# Altium project max2606_VCO.PrjPcb
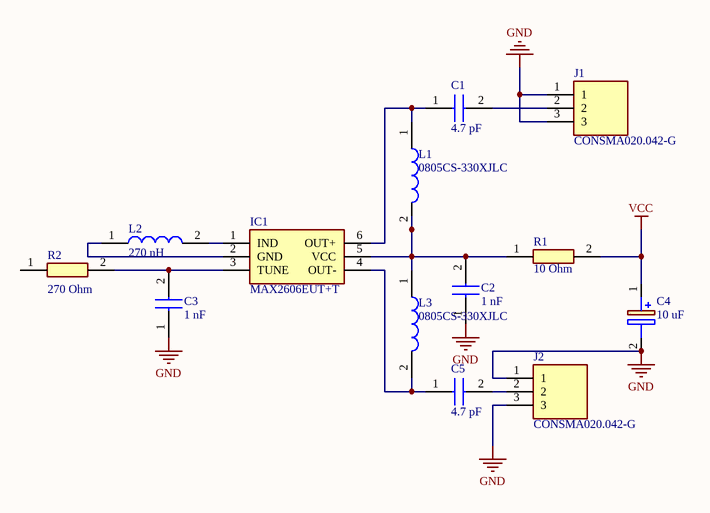
[diagram p0: vco_max2606.SchDoc]
1 sheet, 13 parts. Net scope: global (net labels, ports and power ports of the same name join across sheets).
Board file: VCO_Max2606.PcbDoc

## Sheet vco_max2606.SchDoc
size A4; SheetNumber: 1; SheetTotal: 1

### Parts
C1  4.7 pF  [CAPC1608X90N]
C2  1 nF  [CAPC1608X90N]
C3  1 nF  [CAPC1608X90N]
C4  10 uF  [CAPPM3216X180N]
C5  4.7 pF  [CAPC1608X90N]
IC1  MAX2606EUT+T  [SOT95P280X145-6N]
J1  CONSMA020.042-G  [CONSMA020042G]
J2  CONSMA020.042-G  [CONSMA020042G]
L1  0805CS-330XJLC  [CAPC2012X130N]
L2  270 nH  [INDC2012X105N]
L3  0805CS-330XJLC  [CAPC2012X130N]
R1  10 Ohm  [RESC1608X55N]
R2  270 Ohm  [RESC2012X65N]

### Nets
GND: C2.1 C3.1 C4.2(-) J1.1 J1.3 J2.1 J2.3
VCC: C4.1(+) R1.2
NetC1_1: C1.1 IC1.6(OUT+) L1.1
NetC1_2: C1.2 J1.2
NetC2_2: C2.2 IC1.5(VCC) L1.2 L3.1 R1.1
NetC3_2: C3.2 IC1.3(TUNE) R2.2
NetC5_1: C5.1 IC1.4(OUT-) L3.2
NetC5_2: C5.2 J2.2
NetIC1_1: IC1.1(IND) L2.2
NetIC1_2: IC1.2(GND) L2.1

Not connected (* = marked no-connect by the designer): R2 1

### Library data of the parts
C1 C5 = CL10C4R7BB8NNNC: Capacitor; Manufacturer_Name: SAMSUNG; Datasheet Link: https://datasheet.datasheetarchive.com/originals/distributors/Datasheets_SAMA/0a1f72ba4d3cd833564e5daafcd80580.pdf; Height: 0.9mm; Manufacturer_Part_Number: CL10C4R7BB8NNNC; Mouser Part Number: N/A; Mouser Price/Stock: https://www.mouser.com/Search/Refine.aspx?Keyword=N%2FA; Arrow Part Number: CL10C4R7BB8NNNC; Arrow Price/Stock: https://www.arrow.com/en/products/cl10c4r7bb8nnnc/samsung-electro-mechanics
C2 C3 = 06033D224MAT4A: Capacitor; Manufacturer_Name: Kyocera AVX; Datasheet Link: https://componentsearchengine.com/Datasheets/1/06031A100FAT2A.pdf; Height: 0.9mm; Manufacturer_Part_Number: 06033D224MAT4A; Mouser Part Number: 581-06033D224MAT4A; Mouser Price/Stock: https://www.mouser.co.uk/ProductDetail/AVX/06033D224MAT4A?qs=XLNwXgtzMM%2FMFiOH0A%252BeuQ%3D%3D
C4 = T491A106M010AT7454: Capacitor Polarised; Manufacturer_Name: KEMET; Datasheet Link: https://connect.kemet.com:7667/gateway/IntelliData-ComponentDocumentation/1.0/download/specsheet/T491A106M010AT; Height: 1.8mm; Manufacturer_Part_Number: T491A106M010AT7454; Mouser Part Number: 80-T491A106M10AT7454; Mouser Price/Stock: https://www.mouser.co.uk/ProductDetail/KEMET/T491A106M010AT7454?qs=WOKUqv%2F%2FT%2FY3El0Op9fdSQ%3D%3D; Arrow Part Number: T491A106M010AT7454; Arrow Price/Stock: https://www.arrow.com/en/products/t491a106m010at7454/kemet-corporation?region=nac
IC1 = MAX2606EUT+T: Integrated Circuit; Manufacturer_Name: Analog Devices; Datasheet Link: https://www.mouser.co.uk/datasheet/2/256/MAX2605-MAX2609-1515582.pdf; Height: 1.45mm; Manufacturer_Part_Number: MAX2606EUT+T; Mouser Part Number: 700-MAX2606EUTT; Mouser Price/Stock: https://www.mouser.co.uk/ProductDetail/Analog-Devices-Maxim-Integrated/MAX2606EUT%2bT?qs=GxOUx7aO6nxQrK5ySdDhWg%3D%3D
J1 J2 = CONSMA020.042-G: Connector; Manufacturer_Name: Linx Technologies; Datasheet Link: https://linxtechnologies.com/wp/wp-content/uploads/consma020.042-g-ds.pdf; Height: 7.92mm; Manufacturer_Part_Number: CONSMA020.042-G; Mouser Part Number: 712-CONSMA020.042-G; Mouser Price/Stock: https://www.mouser.co.uk/ProductDetail/Linx-Technologies/CONSMA020.042-G?qs=7D1LtPJG0i3DlJhqoQK7wQ%3D%3D
L1 L3 = 0805CS-330XJLC: Inductor; Manufacturer_Name: COILCRAFT; Datasheet Link: https://www.coilcraft.com/getmedia/dd5f20e4-1ff7-43df-8317-b693eb2dce3e/0805cs.pdf; Height: 1.52mm; Manufacturer_Part_Number: 0805CS-330XJLC; Mouser Part Number: 994-0805CS-330XJLC; Mouser Price/Stock: https://www.mouser.com/Search/Refine.aspx?Keyword=994-0805CS-330XJLC
L2 = MLF2012DR27JTD25: Inductor; Manufacturer_Name: TDK; Datasheet Link: https://product.tdk.com/system/files/dam/doc/product/inductor/inductor/smd/catalog/inductor_automotive_standard_mlf2012_en.pdf; Height: 1.05mm; Manufacturer_Part_Number: MLF2012DR27JTD25; Mouser Part Number: 810-MLF2012DR27JTD25; Mouser Price/Stock: https://www.mouser.co.uk/ProductDetail/TDK/MLF2012DR27JTD25?qs=u4%252BEJ9urDAQ6h1SpGgiCDg%3D%3D
R1 = RT0603FRD0710RL: Resistor; Manufacturer_Name: KEMET; Datasheet Link: https://datasheet.datasheetarchive.com/originals/distributors/Datasheets_SAMA/a1f8f48f216d234b3e6a96d43a77a0c1.pdf; Height: 0.55mm; Manufacturer_Part_Number: RT0603FRD0710RL; Mouser Part Number: 603-RT0603FRD0710RL; Mouser Price/Stock: https://www.mouser.co.uk/ProductDetail/Yageo/RT0603FRD0710RL/?qs=k2KEx2DUIRT6hVLH%252BBT1HQ%3D%3D
R2 = PCF0805R-3K24BT1: Resistor; Manufacturer_Name: TT Electronics; Datasheet Link: https://componentsearchengine.com/Datasheets/1/PCF0805-13-10KBT1.pdf; Height: 0.65mm; Manufacturer_Part_Number: PCF0805R-3K24BT1; Mouser Part Number: 756-PCF0805R3K24BT1; Mouser Price/Stock: https://www.mouser.com/Search/Refine.aspx?Keyword=756-PCF0805R3K24BT1